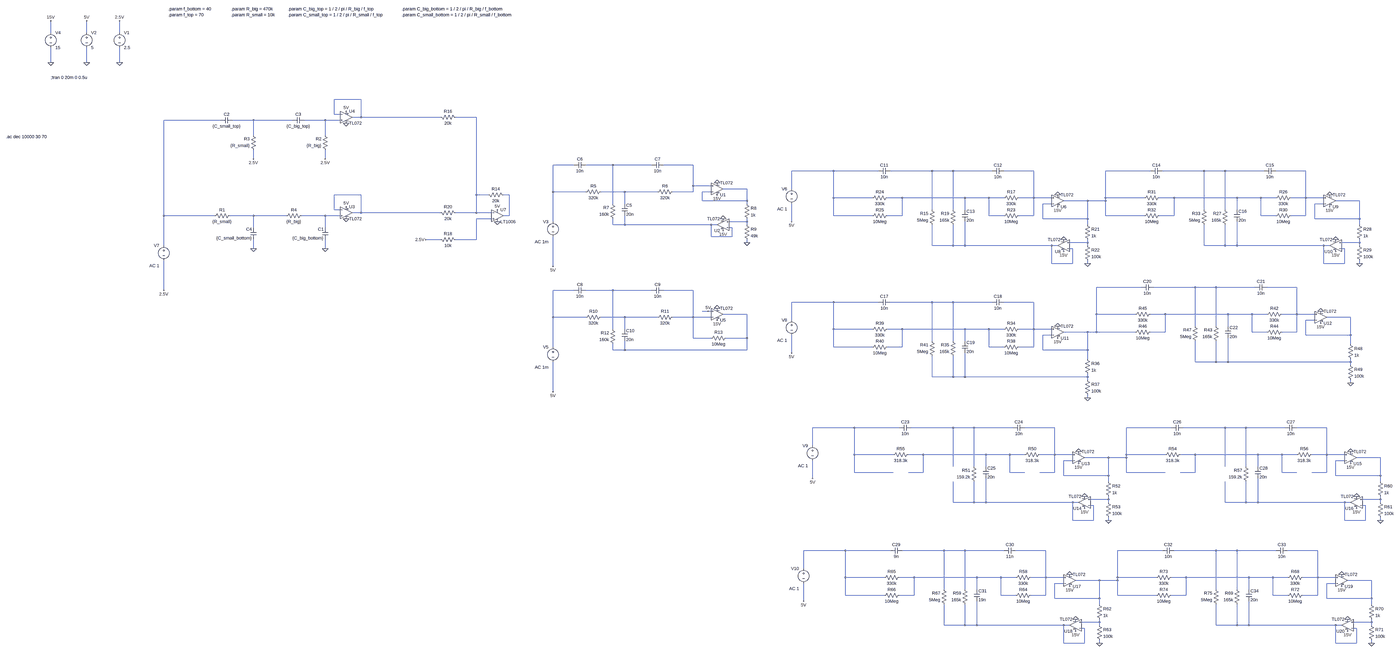
[diagram p0: schematic mains_bandstop_2.asc, whole sheet]
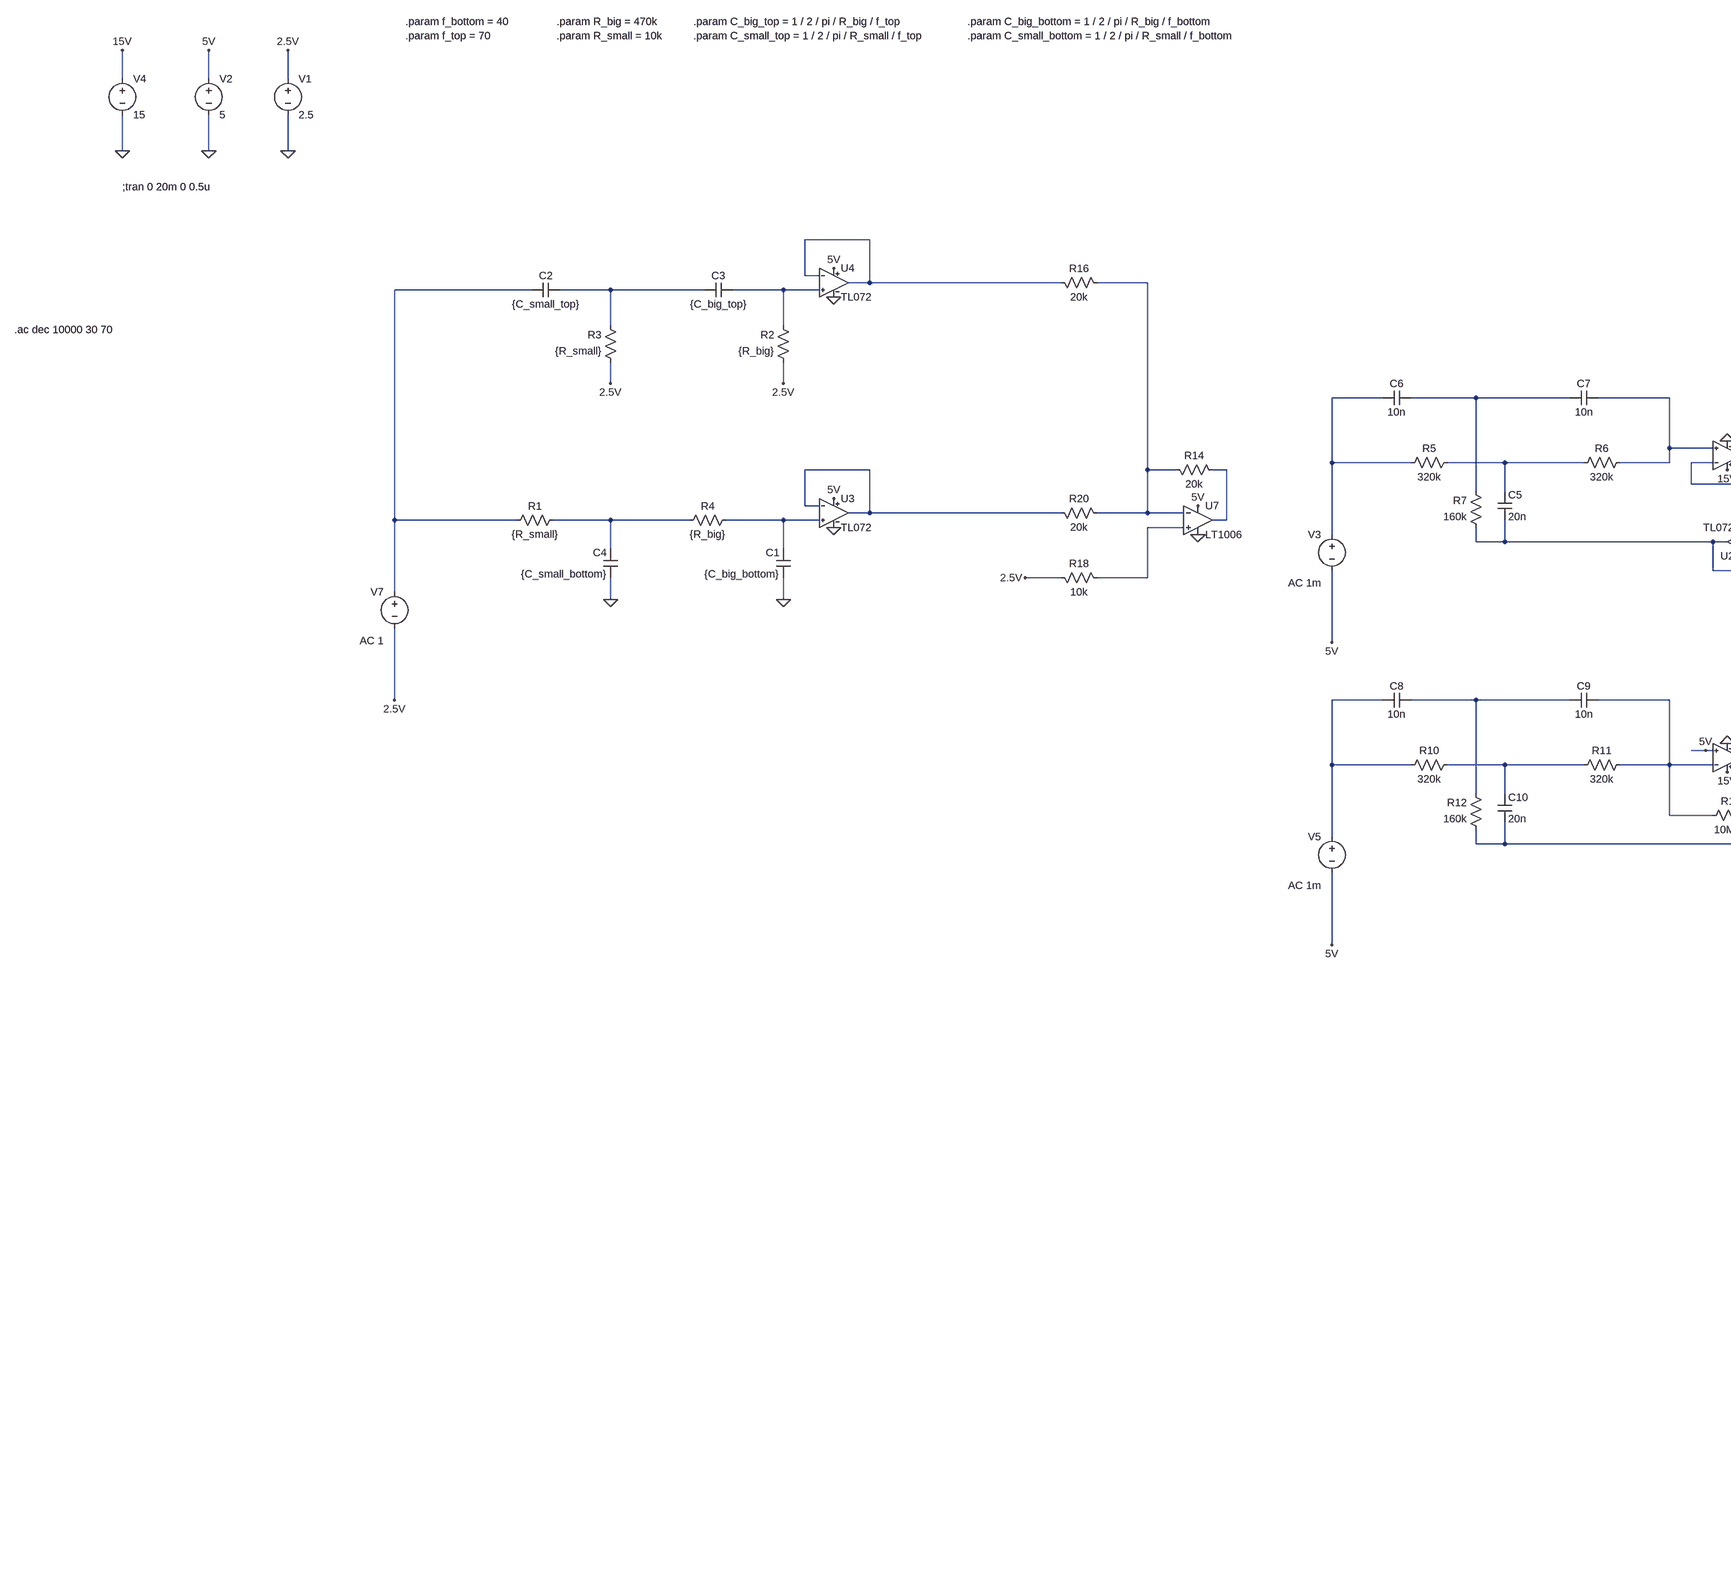
[diagram p1: schematic mains_bandstop_2.asc, part, row 1 of 1, column 1 of 2]
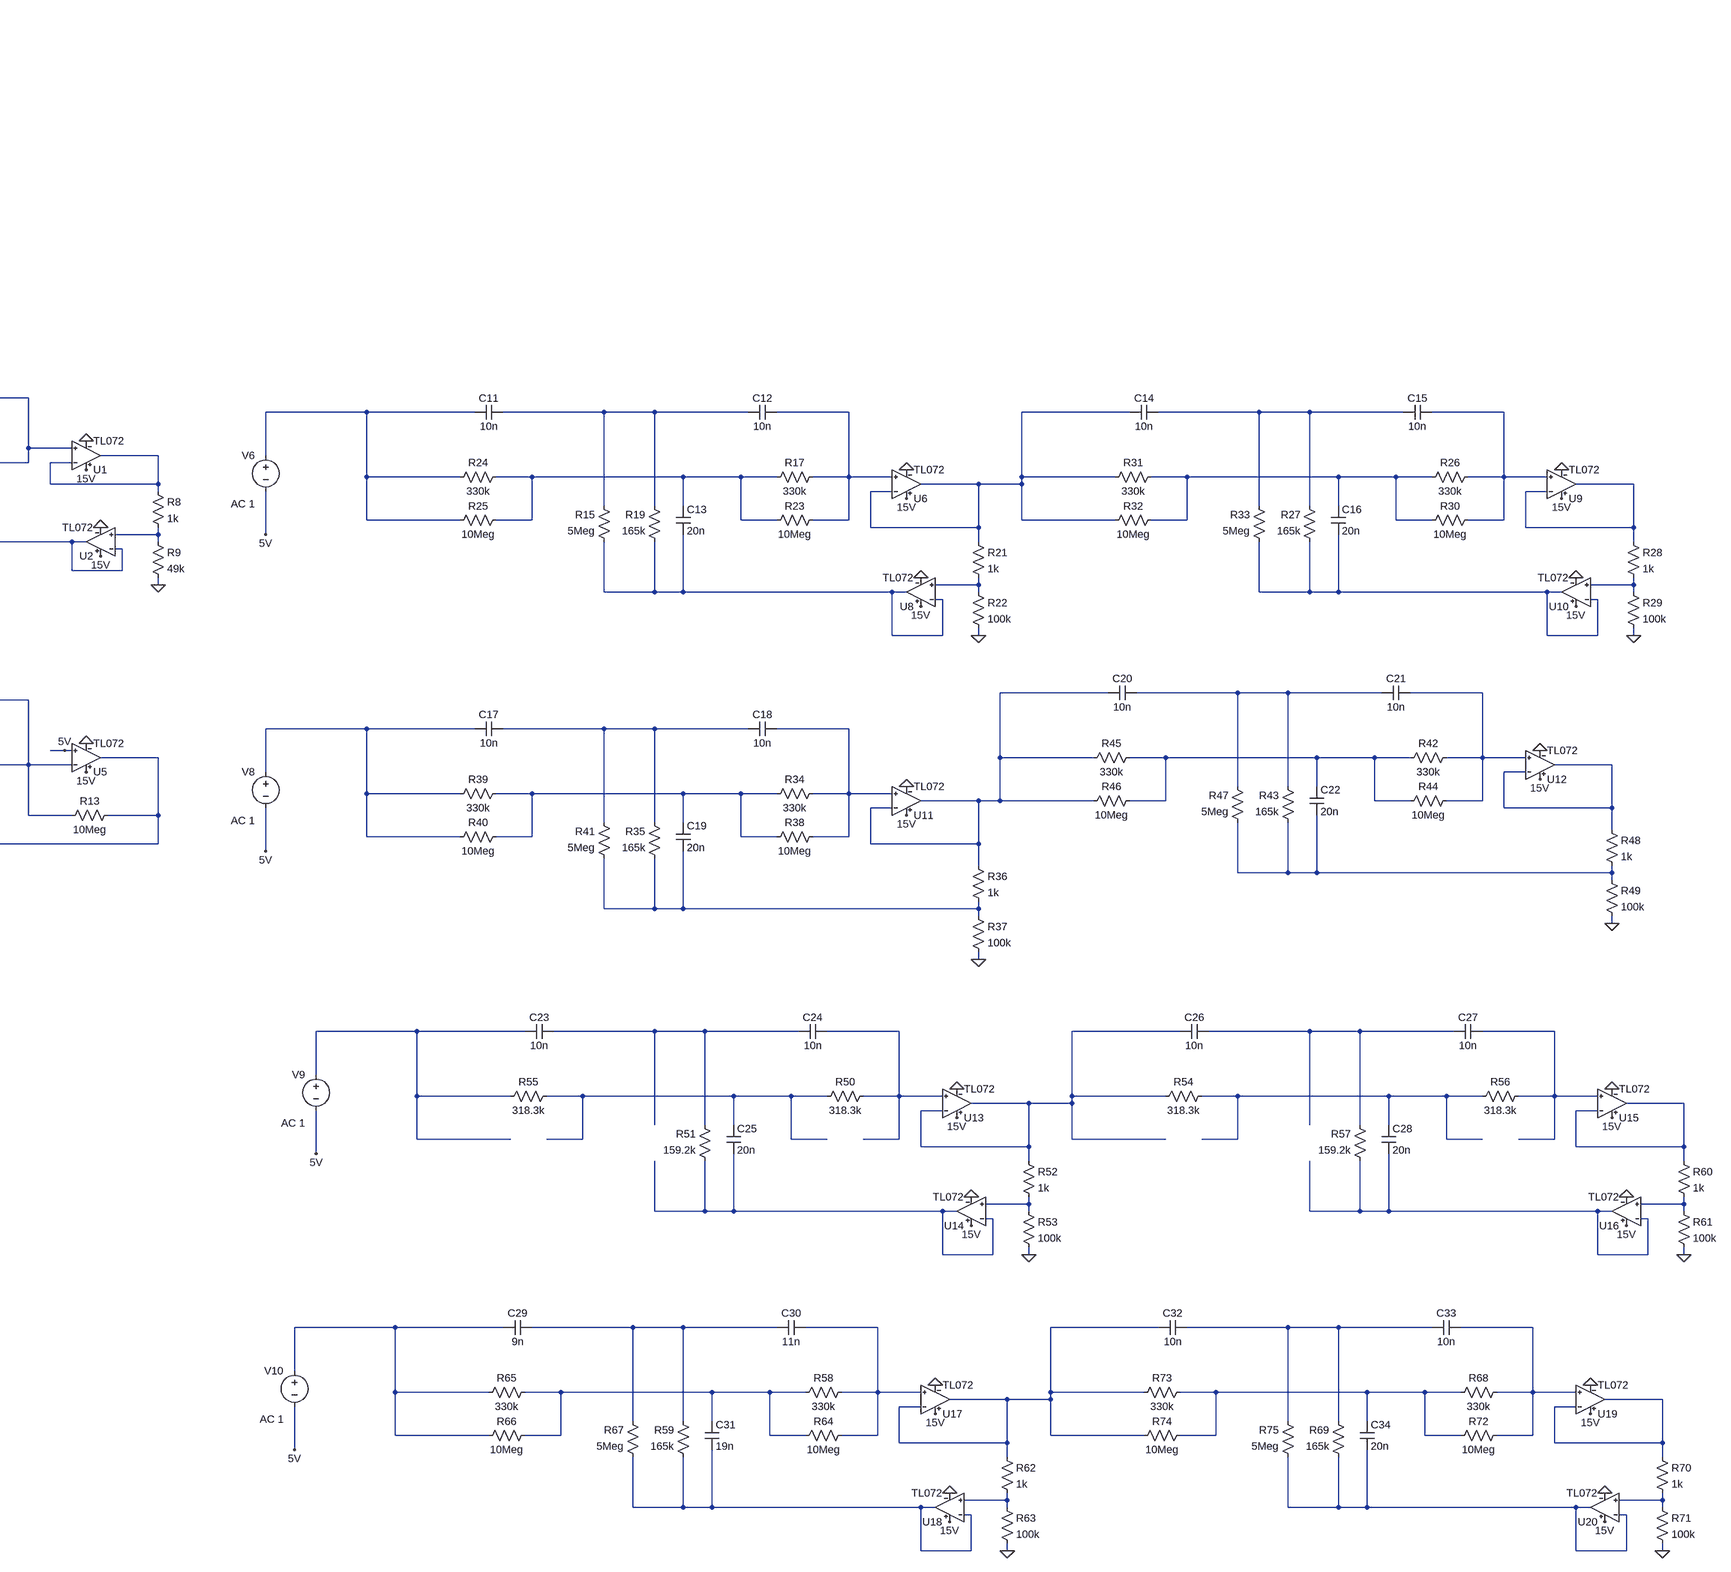
[diagram p2: schematic mains_bandstop_2.asc, part, row 1 of 1, column 2 of 2]
mains_bandstop_2.asc, the LTspice schematic file:
Version 4
SHEET 1 5728 3468
WIRE -1648 -272 -1648 -336
WIRE -1456 -272 -1456 -336
WIRE -1280 -272 -1280 -336
WIRE -1648 -112 -1648 -192
WIRE -1456 -112 -1456 -192
WIRE -1280 -112 -1280 -192
WIRE 48 160 -96 160
WIRE -96 240 -96 160
WIRE -64 240 -96 240
WIRE 48 256 48 160
WIRE 48 256 0 256
WIRE 480 256 48 256
WIRE 672 256 560 256
WIRE -704 272 -1008 272
WIRE -528 272 -640 272
WIRE -320 272 -528 272
WIRE -144 272 -256 272
WIRE -64 272 -144 272
WIRE -528 352 -528 272
WIRE -144 352 -144 272
WIRE -528 480 -528 432
WIRE -144 480 -144 432
WIRE 1264 512 1152 512
WIRE 1472 512 1328 512
WIRE 1680 512 1472 512
WIRE 1904 512 1744 512
WIRE 2720 544 2496 544
WIRE 2960 544 2720 544
WIRE 3248 544 3024 544
WIRE 3360 544 3248 544
WIRE 3568 544 3360 544
WIRE 3792 544 3632 544
WIRE 4416 544 4176 544
WIRE 4704 544 4480 544
WIRE 4816 544 4704 544
WIRE 5024 544 4816 544
WIRE 5248 544 5088 544
WIRE 1904 624 1904 512
WIRE 2000 624 1904 624
WIRE 2192 640 2064 640
WIRE 2496 640 2496 544
WIRE 1152 656 1152 512
WIRE 1328 656 1152 656
WIRE 1536 656 1408 656
WIRE 1712 656 1536 656
WIRE 1904 656 1904 624
WIRE 1904 656 1792 656
WIRE 2000 656 1952 656
WIRE 48 672 -96 672
WIRE 672 672 672 256
WIRE 736 672 672 672
WIRE 848 672 816 672
WIRE 2720 688 2720 544
WIRE 2928 688 2720 688
WIRE 3088 688 3008 688
WIRE 3424 688 3088 688
WIRE 3552 688 3424 688
WIRE 3632 688 3552 688
WIRE 3792 688 3792 544
WIRE 3792 688 3712 688
WIRE 3888 688 3792 688
WIRE 4176 688 4176 544
WIRE 4384 688 4176 688
WIRE 4544 688 4464 688
WIRE 4880 688 4544 688
WIRE 5008 688 4880 688
WIRE 5088 688 5008 688
WIRE 5248 688 5248 544
WIRE 5248 688 5168 688
WIRE 5344 688 5248 688
WIRE 1952 704 1952 656
WIRE 2192 704 2192 640
WIRE 2192 704 1952 704
WIRE 4080 704 3952 704
WIRE 4176 704 4176 688
WIRE 4176 704 4080 704
WIRE 5536 704 5408 704
WIRE 1472 720 1472 512
WIRE 1536 720 1536 656
WIRE 2192 720 2192 704
WIRE 3888 720 3840 720
WIRE 5344 720 5296 720
WIRE -96 752 -96 672
WIRE -64 752 -96 752
WIRE 3248 752 3248 544
WIRE 3360 752 3360 544
WIRE 3424 752 3424 688
WIRE 4704 752 4704 544
WIRE 4816 752 4816 544
WIRE 4880 752 4880 688
WIRE 48 768 48 672
WIRE 48 768 0 768
WIRE 480 768 48 768
WIRE 672 768 672 672
WIRE 672 768 560 768
WIRE 752 768 672 768
WIRE -1008 784 -1008 272
WIRE -736 784 -1008 784
WIRE -528 784 -656 784
WIRE -352 784 -528 784
WIRE -144 784 -272 784
WIRE -64 784 -144 784
WIRE 848 784 848 672
WIRE 848 784 816 784
WIRE 2720 784 2720 688
WIRE 2928 784 2720 784
WIRE 3088 784 3088 688
WIRE 3088 784 3008 784
WIRE 3552 784 3552 688
WIRE 3632 784 3552 784
WIRE 3792 784 3792 688
WIRE 3792 784 3712 784
WIRE 4176 784 4176 704
WIRE 4384 784 4176 784
WIRE 4544 784 4544 688
WIRE 4544 784 4464 784
WIRE 5008 784 5008 688
WIRE 5088 784 5008 784
WIRE 5248 784 5248 688
WIRE 5248 784 5168 784
WIRE 752 800 672 800
WIRE 3840 800 3840 720
WIRE 4080 800 4080 704
WIRE 4080 800 3840 800
WIRE 5296 800 5296 720
WIRE 5536 800 5536 704
WIRE 5536 800 5296 800
WIRE 1152 816 1152 656
WIRE 2192 816 2192 800
WIRE 2192 816 2096 816
WIRE 2496 816 2496 720
WIRE 1472 832 1472 800
WIRE 1536 832 1536 784
WIRE 1536 832 1472 832
WIRE 2000 832 1536 832
WIRE 2032 832 2000 832
WIRE 2192 832 2192 816
WIRE 4080 832 4080 800
WIRE 5536 832 5536 800
WIRE -528 848 -528 784
WIRE -144 848 -144 784
WIRE 2112 848 2096 848
WIRE 2000 896 2000 832
WIRE 2112 896 2112 848
WIRE 2112 896 2000 896
WIRE 480 912 400 912
WIRE 672 912 672 800
WIRE 672 912 560 912
WIRE 2192 928 2192 912
WIRE 4080 928 4080 912
WIRE 4080 928 3984 928
WIRE 5536 928 5536 912
WIRE 5536 928 5440 928
WIRE -1008 944 -1008 784
WIRE 3248 944 3248 832
WIRE 3360 944 3360 832
WIRE 3360 944 3248 944
WIRE 3424 944 3424 816
WIRE 3424 944 3360 944
WIRE 3888 944 3424 944
WIRE 3920 944 3888 944
WIRE 4080 944 4080 928
WIRE 4704 944 4704 832
WIRE 4816 944 4816 832
WIRE 4816 944 4704 944
WIRE 4880 944 4880 816
WIRE 4880 944 4816 944
WIRE 5344 944 4880 944
WIRE 5376 944 5344 944
WIRE 5536 944 5536 928
WIRE -528 960 -528 912
WIRE -144 960 -144 912
WIRE 4000 960 3984 960
WIRE 5456 960 5440 960
WIRE 3888 1040 3888 944
WIRE 4000 1040 4000 960
WIRE 4000 1040 3888 1040
WIRE 4080 1040 4080 1024
WIRE 5344 1040 5344 944
WIRE 5456 1040 5456 960
WIRE 5456 1040 5344 1040
WIRE 5536 1040 5536 1024
WIRE 1152 1056 1152 896
WIRE 4368 1168 4128 1168
WIRE 4656 1168 4432 1168
WIRE 4768 1168 4656 1168
WIRE 4976 1168 4768 1168
WIRE 5200 1168 5040 1168
WIRE -1008 1184 -1008 1024
WIRE 1264 1184 1152 1184
WIRE 1472 1184 1328 1184
WIRE 1680 1184 1472 1184
WIRE 1904 1184 1744 1184
WIRE 2720 1248 2496 1248
WIRE 2960 1248 2720 1248
WIRE 3248 1248 3024 1248
WIRE 3360 1248 3248 1248
WIRE 3568 1248 3360 1248
WIRE 3792 1248 3632 1248
WIRE 1984 1296 1952 1296
WIRE 2000 1296 1984 1296
WIRE 2192 1312 2064 1312
WIRE 4128 1312 4128 1168
WIRE 4336 1312 4128 1312
WIRE 4496 1312 4416 1312
WIRE 4832 1312 4496 1312
WIRE 4960 1312 4832 1312
WIRE 5040 1312 4960 1312
WIRE 5200 1312 5200 1168
WIRE 5200 1312 5120 1312
WIRE 5296 1312 5200 1312
WIRE 1152 1328 1152 1184
WIRE 1328 1328 1152 1328
WIRE 1536 1328 1408 1328
WIRE 1712 1328 1536 1328
WIRE 1904 1328 1904 1184
WIRE 1904 1328 1792 1328
WIRE 2000 1328 1904 1328
WIRE 5488 1328 5360 1328
WIRE 2496 1344 2496 1248
WIRE 5296 1344 5248 1344
WIRE 4656 1376 4656 1168
WIRE 4768 1376 4768 1168
WIRE 4832 1376 4832 1312
WIRE 1472 1392 1472 1184
WIRE 1536 1392 1536 1328
WIRE 2720 1392 2720 1248
WIRE 2928 1392 2720 1392
WIRE 3088 1392 3008 1392
WIRE 3424 1392 3088 1392
WIRE 3552 1392 3424 1392
WIRE 3632 1392 3552 1392
WIRE 3792 1392 3792 1248
WIRE 3792 1392 3712 1392
WIRE 3888 1392 3792 1392
WIRE 4080 1408 3952 1408
WIRE 4128 1408 4128 1312
WIRE 4128 1408 4080 1408
WIRE 4336 1408 4128 1408
WIRE 4496 1408 4496 1312
WIRE 4496 1408 4416 1408
WIRE 4960 1408 4960 1312
WIRE 5040 1408 4960 1408
WIRE 5200 1408 5200 1312
WIRE 5200 1408 5120 1408
WIRE 3888 1424 3840 1424
WIRE 5248 1424 5248 1344
WIRE 5488 1424 5488 1328
WIRE 5488 1424 5248 1424
WIRE 1904 1440 1904 1328
WIRE 2000 1440 1904 1440
WIRE 2192 1440 2192 1312
WIRE 2192 1440 2080 1440
WIRE 3248 1456 3248 1248
WIRE 3360 1456 3360 1248
WIRE 3424 1456 3424 1392
WIRE 5488 1472 5488 1424
WIRE 1152 1488 1152 1328
WIRE 2720 1488 2720 1392
WIRE 2928 1488 2720 1488
WIRE 3088 1488 3088 1392
WIRE 3088 1488 3008 1488
WIRE 3552 1488 3552 1392
WIRE 3632 1488 3552 1488
WIRE 3792 1488 3792 1392
WIRE 3792 1488 3712 1488
WIRE 1472 1504 1472 1472
WIRE 1536 1504 1536 1456
WIRE 1536 1504 1472 1504
WIRE 2192 1504 2192 1440
WIRE 2192 1504 1536 1504
WIRE 3840 1504 3840 1424
WIRE 4080 1504 4080 1408
WIRE 4080 1504 3840 1504
WIRE 2496 1520 2496 1424
WIRE 4080 1552 4080 1504
WIRE 4656 1568 4656 1456
WIRE 4768 1568 4768 1456
WIRE 4768 1568 4656 1568
WIRE 4832 1568 4832 1440
WIRE 4832 1568 4768 1568
WIRE 5488 1568 5488 1552
WIRE 5488 1568 4832 1568
WIRE 5488 1584 5488 1568
WIRE 3248 1648 3248 1536
WIRE 3360 1648 3360 1536
WIRE 3360 1648 3248 1648
WIRE 3424 1648 3424 1520
WIRE 3424 1648 3360 1648
WIRE 4080 1648 4080 1632
WIRE 4080 1648 3424 1648
WIRE 4080 1664 4080 1648
WIRE 5488 1680 5488 1664
WIRE 1152 1728 1152 1568
WIRE 4080 1760 4080 1744
WIRE 2832 1984 2608 1984
WIRE 3072 1984 2832 1984
WIRE 3360 1984 3136 1984
WIRE 3472 1984 3360 1984
WIRE 3680 1984 3472 1984
WIRE 3904 1984 3744 1984
WIRE 4528 1984 4288 1984
WIRE 4816 1984 4592 1984
WIRE 4928 1984 4816 1984
WIRE 5136 1984 4928 1984
WIRE 5360 1984 5200 1984
WIRE 2608 2080 2608 1984
WIRE 2832 2128 2832 1984
WIRE 3040 2128 2832 2128
WIRE 3200 2128 3120 2128
WIRE 3536 2128 3200 2128
WIRE 3664 2128 3536 2128
WIRE 3744 2128 3664 2128
WIRE 3904 2128 3904 1984
WIRE 3904 2128 3824 2128
WIRE 4000 2128 3904 2128
WIRE 4288 2128 4288 1984
WIRE 4496 2128 4288 2128
WIRE 4656 2128 4576 2128
WIRE 4992 2128 4656 2128
WIRE 5120 2128 4992 2128
WIRE 5200 2128 5120 2128
WIRE 5360 2128 5360 1984
WIRE 5360 2128 5280 2128
WIRE 5456 2128 5360 2128
WIRE 4192 2144 4064 2144
WIRE 4288 2144 4288 2128
WIRE 4288 2144 4192 2144
WIRE 5648 2144 5520 2144
WIRE 4000 2160 3952 2160
WIRE 5456 2160 5408 2160
WIRE 3360 2192 3360 1984
WIRE 3472 2192 3472 1984
WIRE 3536 2192 3536 2128
WIRE 4816 2192 4816 1984
WIRE 4928 2192 4928 1984
WIRE 4992 2192 4992 2128
WIRE 2832 2224 2832 2128
WIRE 3040 2224 2832 2224
WIRE 3200 2224 3200 2128
WIRE 3200 2224 3120 2224
WIRE 3664 2224 3664 2128
WIRE 3744 2224 3664 2224
WIRE 3904 2224 3904 2128
WIRE 3904 2224 3824 2224
WIRE 4288 2224 4288 2144
WIRE 4496 2224 4288 2224
WIRE 4656 2224 4656 2128
WIRE 4656 2224 4576 2224
WIRE 5120 2224 5120 2128
WIRE 5200 2224 5120 2224
WIRE 5360 2224 5360 2128
WIRE 5360 2224 5280 2224
WIRE 3952 2240 3952 2160
WIRE 4192 2240 4192 2144
WIRE 4192 2240 3952 2240
WIRE 5408 2240 5408 2160
WIRE 5648 2240 5648 2144
WIRE 5648 2240 5408 2240
WIRE 2608 2256 2608 2160
WIRE 4192 2272 4192 2240
WIRE 5648 2272 5648 2240
WIRE 4192 2368 4192 2352
WIRE 4192 2368 4096 2368
WIRE 5648 2368 5648 2352
WIRE 5648 2368 5552 2368
WIRE 3360 2384 3360 2272
WIRE 3472 2384 3472 2272
WIRE 3472 2384 3360 2384
WIRE 3536 2384 3536 2256
WIRE 3536 2384 3472 2384
WIRE 4000 2384 3536 2384
WIRE 4032 2384 4000 2384
WIRE 4192 2384 4192 2368
WIRE 4816 2384 4816 2272
WIRE 4928 2384 4928 2272
WIRE 4928 2384 4816 2384
WIRE 4992 2384 4992 2256
WIRE 4992 2384 4928 2384
WIRE 5456 2384 4992 2384
WIRE 5488 2384 5456 2384
WIRE 5648 2384 5648 2368
WIRE 4112 2400 4096 2400
WIRE 5568 2400 5552 2400
WIRE 4000 2480 4000 2384
WIRE 4112 2480 4112 2400
WIRE 4112 2480 4000 2480
WIRE 4192 2480 4192 2464
WIRE 5456 2480 5456 2384
WIRE 5568 2480 5568 2400
WIRE 5568 2480 5456 2480
WIRE 5648 2480 5648 2464
WIRE 2784 2944 2560 2944
WIRE 3024 2944 2784 2944
WIRE 3312 2944 3088 2944
WIRE 3424 2944 3312 2944
WIRE 3632 2944 3424 2944
WIRE 3856 2944 3696 2944
WIRE 4480 2944 4240 2944
WIRE 4768 2944 4544 2944
WIRE 4880 2944 4768 2944
WIRE 5088 2944 4880 2944
WIRE 5312 2944 5152 2944
WIRE 2560 3040 2560 2944
WIRE 2784 3088 2784 2944
WIRE 2992 3088 2784 3088
WIRE 3152 3088 3072 3088
WIRE 3488 3088 3152 3088
WIRE 3616 3088 3488 3088
WIRE 3696 3088 3616 3088
WIRE 3856 3088 3856 2944
WIRE 3856 3088 3776 3088
WIRE 3952 3088 3856 3088
WIRE 4240 3088 4240 2944
WIRE 4448 3088 4240 3088
WIRE 4608 3088 4528 3088
WIRE 4944 3088 4608 3088
WIRE 5072 3088 4944 3088
WIRE 5152 3088 5072 3088
WIRE 5312 3088 5312 2944
WIRE 5312 3088 5232 3088
WIRE 5408 3088 5312 3088
WIRE 4144 3104 4016 3104
WIRE 4240 3104 4240 3088
WIRE 4240 3104 4144 3104
WIRE 5600 3104 5472 3104
WIRE 3952 3120 3904 3120
WIRE 5408 3120 5360 3120
WIRE 3312 3152 3312 2944
WIRE 3424 3152 3424 2944
WIRE 3488 3152 3488 3088
WIRE 4768 3152 4768 2944
WIRE 4880 3152 4880 2944
WIRE 4944 3152 4944 3088
WIRE 2784 3184 2784 3088
WIRE 2992 3184 2784 3184
WIRE 3152 3184 3152 3088
WIRE 3152 3184 3072 3184
WIRE 3616 3184 3616 3088
WIRE 3696 3184 3616 3184
WIRE 3856 3184 3856 3088
WIRE 3856 3184 3776 3184
WIRE 4240 3184 4240 3104
WIRE 4448 3184 4240 3184
WIRE 4608 3184 4608 3088
WIRE 4608 3184 4528 3184
WIRE 5072 3184 5072 3088
WIRE 5152 3184 5072 3184
WIRE 5312 3184 5312 3088
WIRE 5312 3184 5232 3184
WIRE 3904 3200 3904 3120
WIRE 4144 3200 4144 3104
WIRE 4144 3200 3904 3200
WIRE 5360 3200 5360 3120
WIRE 5600 3200 5600 3104
WIRE 5600 3200 5360 3200
WIRE 2560 3216 2560 3120
WIRE 4144 3232 4144 3200
WIRE 5600 3232 5600 3200
WIRE 4144 3328 4144 3312
WIRE 4144 3328 4048 3328
WIRE 5600 3328 5600 3312
WIRE 5600 3328 5504 3328
WIRE 3312 3344 3312 3232
WIRE 3424 3344 3424 3232
WIRE 3424 3344 3312 3344
WIRE 3488 3344 3488 3216
WIRE 3488 3344 3424 3344
WIRE 3952 3344 3488 3344
WIRE 3984 3344 3952 3344
WIRE 4144 3344 4144 3328
WIRE 4768 3344 4768 3232
WIRE 4880 3344 4880 3232
WIRE 4880 3344 4768 3344
WIRE 4944 3344 4944 3216
WIRE 4944 3344 4880 3344
WIRE 5408 3344 4944 3344
WIRE 5440 3344 5408 3344
WIRE 5600 3344 5600 3328
WIRE 4064 3360 4048 3360
WIRE 5520 3360 5504 3360
WIRE 3952 3440 3952 3344
WIRE 4064 3440 4064 3360
WIRE 4064 3440 3952 3440
WIRE 4144 3440 4144 3424
WIRE 5408 3440 5408 3344
WIRE 5520 3440 5520 3360
WIRE 5520 3440 5408 3440
WIRE 5600 3440 5600 3424
FLAG -1456 -112 0
FLAG -1456 -336 5V
FLAG 784 816 0
FLAG 784 752 5V
FLAG 400 912 2.5V
FLAG -1280 -112 0
FLAG -1280 -336 2.5V
FLAG -32 800 0
FLAG -32 736 5V
FLAG -144 960 0
FLAG -32 288 0
FLAG -32 224 5V
FLAG -1008 1184 2.5V
FLAG -144 480 2.5V
FLAG -528 480 2.5V
FLAG -528 960 0
FLAG 2032 608 0
FLAG 2032 672 15V
FLAG 1152 1056 5V
FLAG 2064 800 0
FLAG 2064 864 15V
FLAG 2192 928 0
FLAG -1648 -112 0
FLAG -1648 -336 15V
FLAG 2032 1280 0
FLAG 2032 1344 15V
FLAG 1152 1728 5V
FLAG 1984 1296 5V
FLAG 3920 672 0
FLAG 3920 736 15V
FLAG 2496 816 5V
FLAG 3952 912 0
FLAG 3952 976 15V
FLAG 4080 1040 0
FLAG 5376 672 0
FLAG 5376 736 15V
FLAG 5408 912 0
FLAG 5408 976 15V
FLAG 5536 1040 0
FLAG 3920 1376 0
FLAG 3920 1440 15V
FLAG 2496 1520 5V
FLAG 4080 1760 0
FLAG 5328 1296 0
FLAG 5328 1360 15V
FLAG 5488 1680 0
FLAG 4032 2112 0
FLAG 4032 2176 15V
FLAG 4064 2352 0
FLAG 4064 2416 15V
FLAG 4192 2480 0
FLAG 5488 2112 0
FLAG 5488 2176 15V
FLAG 5520 2352 0
FLAG 5520 2416 15V
FLAG 5648 2480 0
FLAG 2608 2256 5V
FLAG 3984 3072 0
FLAG 3984 3136 15V
FLAG 2560 3216 5V
FLAG 4016 3312 0
FLAG 4016 3376 15V
FLAG 4144 3440 0
FLAG 5440 3072 0
FLAG 5440 3136 15V
FLAG 5472 3312 0
FLAG 5472 3376 15V
FLAG 5600 3440 0
SYMBOL voltage -1456 -288 R0
WINDOW 123 0 0 Left 0
WINDOW 39 0 0 Left 0
SYMATTR InstName V2
SYMATTR Value 5
SYMBOL voltage -1008 928 M0
WINDOW 123 24 124 Left 2
WINDOW 39 0 0 Left 0
SYMATTR Value2 AC 1
SYMATTR InstName V7
SYMATTR Value ""
SYMBOL res 720 656 M90
WINDOW 0 0 56 VBottom 2
WINDOW 3 32 56 VTop 2
SYMATTR InstName R14
SYMATTR Value 20k
SYMBOL OpAmps\\LT1006 784 720 R0
SYMATTR InstName U7
SYMBOL res 464 896 M90
WINDOW 0 0 56 VBottom 2
WINDOW 3 32 56 VTop 2
SYMATTR InstName R18
SYMATTR Value 10k
SYMBOL res 464 240 M90
WINDOW 0 0 56 VBottom 2
WINDOW 3 32 56 VTop 2
SYMATTR InstName R16
SYMATTR Value 20k
SYMBOL res 464 752 M90
WINDOW 0 0 56 VBottom 2
WINDOW 3 32 56 VTop 2
SYMATTR InstName R20
SYMATTR Value 20k
SYMBOL voltage -1280 -288 R0
WINDOW 123 0 0 Left 0
WINDOW 39 0 0 Left 0
SYMATTR InstName V1
SYMATTR Value 2.5
SYMBOL cap -640 256 R90
WINDOW 0 0 32 VBottom 2
WINDOW 3 32 32 VTop 2
SYMATTR InstName C2
SYMATTR Value {C_small_top}
SYMBOL res -128 448 R180
WINDOW 0 36 76 Left 2
WINDOW 3 36 40 Left 2
SYMATTR InstName R2
SYMATTR Value {R_big}
SYMBOL cap -256 256 R90
WINDOW 0 0 32 VBottom 2
WINDOW 3 32 32 VTop 2
SYMATTR InstName C3
SYMATTR Value {C_big_top}
SYMBOL res -512 448 R180
WINDOW 0 36 76 Left 2
WINDOW 3 36 40 Left 2
SYMATTR InstName R3
SYMATTR Value {R_small}
SYMBOL ZZZ\\OpAmp\\TL072 -32 768 R0
SYMATTR InstName U3
SYMBOL ZZZ\\OpAmp\\TL072 -32 256 R0
SYMATTR InstName U4
SYMBOL res -752 800 R270
WINDOW 0 32 56 VTop 2
WINDOW 3 0 56 VBottom 2
SYMATTR InstName R1
SYMATTR Value {R_small}
SYMBOL res -368 800 R270
WINDOW 0 32 56 VTop 2
WINDOW 3 0 56 VBottom 2
SYMATTR InstName R4
SYMATTR Value {R_big}
SYMBOL cap -512 912 R180
WINDOW 0 24 56 Left 2
WINDOW 3 24 8 Left 2
SYMATTR InstName C4
SYMATTR Value {C_small_bottom}
SYMBOL cap -128 912 R180
WINDOW 0 24 56 Left 2
WINDOW 3 24 8 Left 2
SYMATTR InstName C1
SYMATTR Value {C_big_bottom}
SYMBOL ZZZ\\OpAmp\\TL072 2032 640 M180
SYMATTR InstName U1
SYMBOL res 1312 672 R270
WINDOW 0 32 56 VTop 2
WINDOW 3 0 56 VBottom 2
SYMATTR InstName R5
SYMATTR Value 320k
SYMBOL voltage 1152 800 M0
WINDOW 123 24 124 Left 2
WINDOW 39 0 0 Left 0
SYMATTR Value2 AC 1m
SYMATTR InstName V3
SYMATTR Value ""
SYMBOL res 1696 672 R270
WINDOW 0 32 56 VTop 2
WINDOW 3 0 56 VBottom 2
SYMATTR InstName R6
SYMATTR Value 320k
SYMBOL res 1488 816 R180
WINDOW 0 36 76 Left 2
WINDOW 3 36 40 Left 2
SYMATTR InstName R7
SYMATTR Value 160k
SYMBOL cap 1264 528 R270
WINDOW 0 32 32 VTop 2
WINDOW 3 0 32 VBottom 2
SYMATTR InstName C6
SYMATTR Value 10n
SYMBOL cap 1680 528 R270
WINDOW 0 32 32 VTop 2
WINDOW 3 0 32 VBottom 2
SYMATTR InstName C7
SYMATTR Value 10n
SYMBOL cap 1520 720 R0
SYMATTR InstName C5
SYMATTR Value 20n
SYMBOL ZZZ\\OpAmp\\TL072 2064 832 R180
SYMATTR InstName U2
SYMBOL res 2176 704 R0
SYMATTR InstName R8
SYMATTR Value 1k
SYMBOL res 2176 816 R0
SYMATTR InstName R9
SYMATTR Value 49k
SYMBOL voltage -1648 -288 R0
WINDOW 123 0 0 Left 0
WINDOW 39 0 0 Left 0
SYMATTR InstName V4
SYMATTR Value 15
SYMBOL ZZZ\\OpAmp\\TL072 2032 1312 M180
SYMATTR InstName U5
SYMBOL res 1312 1344 R270
WINDOW 0 32 56 VTop 2
WINDOW 3 0 56 VBottom 2
SYMATTR InstName R10
SYMATTR Value 320k
SYMBOL voltage 1152 1472 M0
WINDOW 123 24 124 Left 2
WINDOW 39 0 0 Left 0
SYMATTR Value2 AC 1m
SYMATTR InstName V5
SYMATTR Value ""
SYMBOL res 1696 1344 R270
WINDOW 0 32 56 VTop 2
WINDOW 3 0 56 VBottom 2
SYMATTR InstName R11
SYMATTR Value 320k
SYMBOL res 1488 1488 R180
WINDOW 0 36 76 Left 2
WINDOW 3 36 40 Left 2
SYMATTR InstName R12
SYMATTR Value 160k
SYMBOL cap 1264 1200 R270
WINDOW 0 32 32 VTop 2
WINDOW 3 0 32 VBottom 2
SYMATTR InstName C8
SYMATTR Value 10n
SYMBOL cap 1680 1200 R270
WINDOW 0 32 32 VTop 2
WINDOW 3 0 32 VBottom 2
SYMATTR InstName C9
SYMATTR Value 10n
SYMBOL cap 1520 1392 R0
SYMATTR InstName C10
SYMATTR Value 20n
SYMBOL res 2096 1424 R90
WINDOW 0 0 56 VBottom 2
WINDOW 3 32 56 VTop 2
SYMATTR InstName R13
SYMATTR Value 10Meg
SYMBOL ZZZ\\OpAmp\\TL072 3920 704 M180
SYMATTR InstName U6
SYMBOL voltage 2496 624 M0
WINDOW 123 24 124 Left 2
WINDOW 39 0 0 Left 0
SYMATTR Value2 AC 1
SYMATTR InstName V6
SYMATTR Value ""
SYMBOL res 3616 704 R270
WINDOW 0 32 56 VTop 2
WINDOW 3 0 56 VBottom 2
SYMATTR InstName R17
SYMATTR Value 330k
SYMBOL res 3376 848 R180
WINDOW 0 36 76 Left 2
WINDOW 3 36 40 Left 2
SYMATTR InstName R19
SYMATTR Value 165k
SYMBOL cap 2960 560 R270
WINDOW 0 32 32 VTop 2
WINDOW 3 0 32 VBottom 2
SYMATTR InstName C11
SYMATTR Value 10n
SYMBOL cap 3568 560 R270
WINDOW 0 32 32 VTop 2
WINDOW 3 0 32 VBottom 2
SYMATTR InstName C12
SYMATTR Value 10n
SYMBOL cap 3408 752 R0
SYMATTR InstName C13
SYMATTR Value 20n
SYMBOL ZZZ\\OpAmp\\TL072 3952 944 R180
SYMATTR InstName U8
SYMBOL res 4064 816 R0
SYMATTR InstName R21
SYMATTR Value 1k
SYMBOL res 4064 928 R0
SYMATTR InstName R22
SYMATTR Value 100k
SYMBOL res 3728 768 R90
WINDOW 0 0 56 VBottom 2
WINDOW 3 32 56 VTop 2
SYMATTR InstName R23
SYMATTR Value 10Meg
SYMBOL res 2912 704 R270
WINDOW 0 32 56 VTop 2
WINDOW 3 0 56 VBottom 2
SYMATTR InstName R24
SYMATTR Value 330k
SYMBOL res 3024 768 R90
WINDOW 0 0 56 VBottom 2
WINDOW 3 32 56 VTop 2
SYMATTR InstName R25
SYMATTR Value 10Meg
SYMBOL res 3264 848 R180
WINDOW 0 36 76 Left 2
WINDOW 3 36 40 Left 2
SYMATTR InstName R15
SYMATTR Value 5Meg
SYMBOL ZZZ\\OpAmp\\TL072 5376 704 M180
SYMATTR InstName U9
SYMBOL res 5072 704 R270
WINDOW 0 32 56 VTop 2
WINDOW 3 0 56 VBottom 2
SYMATTR InstName R26
SYMATTR Value 330k
SYMBOL res 4832 848 R180
WINDOW 0 36 76 Left 2
WINDOW 3 36 40 Left 2
SYMATTR InstName R27
SYMATTR Value 165k
SYMBOL cap 4416 560 R270
WINDOW 0 32 32 VTop 2
WINDOW 3 0 32 VBottom 2
SYMATTR InstName C14
SYMATTR Value 10n
SYMBOL cap 5024 560 R270
WINDOW 0 32 32 VTop 2
WINDOW 3 0 32 VBottom 2
SYMATTR InstName C15
SYMATTR Value 10n
SYMBOL cap 4864 752 R0
SYMATTR InstName C16
SYMATTR Value 20n
SYMBOL ZZZ\\OpAmp\\TL072 5408 944 R180
SYMATTR InstName U10
SYMBOL res 5520 816 R0
SYMATTR InstName R28
SYMATTR Value 1k
SYMBOL res 5520 928 R0
SYMATTR InstName R29
SYMATTR Value 100k
SYMBOL res 5184 768 R90
WINDOW 0 0 56 VBottom 2
WINDOW 3 32 56 VTop 2
SYMATTR InstName R30
SYMATTR Value 10Meg
SYMBOL res 4368 704 R270
WINDOW 0 32 56 VTop 2
WINDOW 3 0 56 VBottom 2
SYMATTR InstName R31
SYMATTR Value 330k
SYMBOL res 4480 768 R90
WINDOW 0 0 56 VBottom 2
WINDOW 3 32 56 VTop 2
SYMATTR InstName R32
SYMATTR Value 10Meg
SYMBOL res 4720 848 R180
WINDOW 0 36 76 Left 2
WINDOW 3 36 40 Left 2
SYMATTR InstName R33
SYMATTR Value 5Meg
SYMBOL ZZZ\\OpAmp\\TL072 3920 1408 M180
SYMATTR InstName U11
SYMBOL voltage 2496 1328 M0
WINDOW 123 24 124 Left 2
WINDOW 39 0 0 Left 0
SYMATTR Value2 AC 1
SYMATTR InstName V8
SYMATTR Value ""
SYMBOL res 3616 1408 R270
WINDOW 0 32 56 VTop 2
WINDOW 3 0 56 VBottom 2
SYMATTR InstName R34
SYMATTR Value 330k
SYMBOL res 3376 1552 R180
WINDOW 0 36 76 Left 2
WINDOW 3 36 40 Left 2
SYMATTR InstName R35
SYMATTR Value 165k
SYMBOL cap 2960 1264 R270
WINDOW 0 32 32 VTop 2
WINDOW 3 0 32 VBottom 2
SYMATTR InstName C17
SYMATTR Value 10n
SYMBOL cap 3568 1264 R270
WINDOW 0 32 32 VTop 2
WINDOW 3 0 32 VBottom 2
SYMATTR InstName C18
SYMATTR Value 10n
SYMBOL cap 3408 1456 R0
SYMATTR InstName C19
SYMATTR Value 20n
SYMBOL res 3728 1472 R90
WINDOW 0 0 56 VBottom 2
WINDOW 3 32 56 VTop 2
SYMATTR InstName R38
SYMATTR Value 10Meg
SYMBOL res 2912 1408 R270
WINDOW 0 32 56 VTop 2
WINDOW 3 0 56 VBottom 2
SYMATTR InstName R39
SYMATTR Value 330k
SYMBOL res 3024 1472 R90
WINDOW 0 0 56 VBottom 2
WINDOW 3 32 56 VTop 2
SYMATTR InstName R40
SYMATTR Value 10Meg
SYMBOL res 3264 1552 R180
WINDOW 0 36 76 Left 2
WINDOW 3 36 40 Left 2
SYMATTR InstName R41
SYMATTR Value 5Meg
SYMBOL res 4064 1536 R0
SYMATTR InstName R36
SYMATTR Value 1k
SYMBOL res 4064 1648 R0
SYMATTR InstName R37
SYMATTR Value 100k
SYMBOL ZZZ\\OpAmp\\TL072 5328 1328 M180
SYMATTR InstName U12
SYMBOL res 5024 1328 R270
WINDOW 0 32 56 VTop 2
WINDOW 3 0 56 VBottom 2
SYMATTR InstName R42
SYMATTR Value 330k
SYMBOL res 4784 1472 R180
WINDOW 0 36 76 Left 2
WINDOW 3 36 40 Left 2
SYMATTR InstName R43
SYMATTR Value 165k
SYMBOL cap 4368 1184 R270
WINDOW 0 32 32 VTop 2
WINDOW 3 0 32 VBottom 2
SYMATTR InstName C20
SYMATTR Value 10n
SYMBOL cap 4976 1184 R270
WINDOW 0 32 32 VTop 2
WINDOW 3 0 32 VBottom 2
SYMATTR InstName C21
SYMATTR Value 10n
SYMBOL cap 4816 1376 R0
SYMATTR InstName C22
SYMATTR Value 20n
SYMBOL res 5136 1392 R90
WINDOW 0 0 56 VBottom 2
WINDOW 3 32 56 VTop 2
SYMATTR InstName R44
SYMATTR Value 10Meg
SYMBOL res 4320 1328 R270
WINDOW 0 32 56 VTop 2
WINDOW 3 0 56 VBottom 2
SYMATTR InstName R45
SYMATTR Value 330k
SYMBOL res 4432 1392 R90
WINDOW 0 0 56 VBottom 2
WINDOW 3 32 56 VTop 2
SYMATTR InstName R46
SYMATTR Value 10Meg
SYMBOL res 4672 1472 R180
WINDOW 0 36 76 Left 2
WINDOW 3 36 40 Left 2
SYMATTR InstName R47
SYMATTR Value 5Meg
SYMBOL res 5472 1456 R0
SYMATTR InstName R48
SYMATTR Value 1k
SYMBOL res 5472 1568 R0
SYMATTR InstName R49
SYMATTR Value 100k
SYMBOL ZZZ\\OpAmp\\TL072 4032 2144 M180
SYMATTR InstName U13
SYMBOL res 3728 2144 R270
WINDOW 0 32 56 VTop 2
WINDOW 3 0 56 VBottom 2
SYMATTR InstName R50
SYMATTR Value 318.3k
SYMBOL res 3488 2288 R180
WINDOW 0 36 76 Left 2
WINDOW 3 36 40 Left 2
SYMATTR InstName R51
SYMATTR Value 159.2k
SYMBOL cap 3072 2000 R270
WINDOW 0 32 32 VTop 2
WINDOW 3 0 32 VBottom 2
SYMATTR InstName C23
SYMATTR Value 10n
SYMBOL cap 3680 2000 R270
WINDOW 0 32 32 VTop 2
WINDOW 3 0 32 VBottom 2
SYMATTR InstName C24
SYMATTR Value 10n
SYMBOL cap 3520 2192 R0
SYMATTR InstName C25
SYMATTR Value 20n
SYMBOL ZZZ\\OpAmp\\TL072 4064 2384 R180
SYMATTR InstName U14
SYMBOL res 4176 2256 R0
SYMATTR InstName R52
SYMATTR Value 1k
SYMBOL res 4176 2368 R0
SYMATTR InstName R53
SYMATTR Value 100k
SYMBOL res 3024 2144 R270
WINDOW 0 32 56 VTop 2
WINDOW 3 0 56 VBottom 2
SYMATTR InstName R55
SYMATTR Value 318.3k
SYMBOL ZZZ\\OpAmp\\TL072 5488 2144 M180
SYMATTR InstName U15
SYMBOL cap 4528 2000 R270
WINDOW 0 32 32 VTop 2
WINDOW 3 0 32 VBottom 2
SYMATTR InstName C26
SYMATTR Value 10n
SYMBOL cap 5136 2000 R270
WINDOW 0 32 32 VTop 2
WINDOW 3 0 32 VBottom 2
SYMATTR InstName C27
SYMATTR Value 10n
SYMBOL cap 4976 2192 R0
SYMATTR InstName C28
SYMATTR Value 20n
SYMBOL ZZZ\\OpAmp\\TL072 5520 2384 R180
SYMATTR InstName U16
SYMBOL res 5632 2256 R0
SYMATTR InstName R60
SYMATTR Value 1k
SYMBOL res 5632 2368 R0
SYMATTR InstName R61
SYMATTR Value 100k
SYMBOL voltage 2608 2064 M0
WINDOW 123 24 124 Left 2
WINDOW 39 0 0 Left 0
SYMATTR Value2 AC 1
SYMATTR InstName V9
SYMATTR Value ""
SYMBOL res 4480 2144 R270
WINDOW 0 32 56 VTop 2
WINDOW 3 0 56 VBottom 2
SYMATTR InstName R54
SYMATTR Value 318.3k
SYMBOL res 5184 2144 R270
WINDOW 0 32 56 VTop 2
WINDOW 3 0 56 VBottom 2
SYMATTR InstName R56
SYMATTR Value 318.3k
SYMBOL res 4944 2288 R180
WINDOW 0 36 76 Left 2
WINDOW 3 36 40 Left 2
SYMATTR InstName R57
SYMATTR Value 159.2k
SYMBOL ZZZ\\OpAmp\\TL072 3984 3104 M180
SYMATTR InstName U17
SYMBOL voltage 2560 3024 M0
WINDOW 123 24 124 Left 2
WINDOW 39 0 0 Left 0
SYMATTR Value2 AC 1
SYMATTR InstName V10
SYMATTR Value ""
SYMBOL res 3680 3104 R270
WINDOW 0 32 56 VTop 2
WINDOW 3 0 56 VBottom 2
SYMATTR InstName R58
SYMATTR Value 330k
SYMBOL res 3440 3248 R180
WINDOW 0 36 76 Left 2
WINDOW 3 36 40 Left 2
SYMATTR InstName R59
SYMATTR Value 165k
SYMBOL cap 3024 2960 R270
WINDOW 0 32 32 VTop 2
WINDOW 3 0 32 VBottom 2
SYMATTR InstName C29
SYMATTR Value 9n
SYMBOL cap 3632 2960 R270
WINDOW 0 32 32 VTop 2
WINDOW 3 0 32 VBottom 2
SYMATTR InstName C30
SYMATTR Value 11n
SYMBOL cap 3472 3152 R0
SYMATTR InstName C31
SYMATTR Value 19n
SYMBOL ZZZ\\OpAmp\\TL072 4016 3344 R180
SYMATTR InstName U18
SYMBOL res 4128 3216 R0
SYMATTR InstName R62
SYMATTR Value 1k
SYMBOL res 4128 3328 R0
SYMATTR InstName R63
SYMATTR Value 100k
SYMBOL res 3792 3168 R90
WINDOW 0 0 56 VBottom 2
WINDOW 3 32 56 VTop 2
SYMATTR InstName R64
SYMATTR Value 10Meg
SYMBOL res 2976 3104 R270
WINDOW 0 32 56 VTop 2
WINDOW 3 0 56 VBottom 2
SYMATTR InstName R65
SYMATTR Value 330k
SYMBOL res 3088 3168 R90
WINDOW 0 0 56 VBottom 2
WINDOW 3 32 56 VTop 2
SYMATTR InstName R66
SYMATTR Value 10Meg
SYMBOL res 3328 3248 R180
WINDOW 0 36 76 Left 2
WINDOW 3 36 40 Left 2
SYMATTR InstName R67
SYMATTR Value 5Meg
SYMBOL ZZZ\\OpAmp\\TL072 5440 3104 M180
SYMATTR InstName U19
SYMBOL res 5136 3104 R270
WINDOW 0 32 56 VTop 2
WINDOW 3 0 56 VBottom 2
SYMATTR InstName R68
SYMATTR Value 330k
SYMBOL res 4896 3248 R180
WINDOW 0 36 76 Left 2
WINDOW 3 36 40 Left 2
SYMATTR InstName R69
SYMATTR Value 165k
SYMBOL cap 4480 2960 R270
WINDOW 0 32 32 VTop 2
WINDOW 3 0 32 VBottom 2
SYMATTR InstName C32
SYMATTR Value 10n
SYMBOL cap 5088 2960 R270
WINDOW 0 32 32 VTop 2
WINDOW 3 0 32 VBottom 2
SYMATTR InstName C33
SYMATTR Value 10n
SYMBOL cap 4928 3152 R0
SYMATTR InstName C34
SYMATTR Value 20n
SYMBOL ZZZ\\OpAmp\\TL072 5472 3344 R180
SYMATTR InstName U20
SYMBOL res 5584 3216 R0
SYMATTR InstName R70
SYMATTR Value 1k
SYMBOL res 5584 3328 R0
SYMATTR InstName R71
SYMATTR Value 100k
SYMBOL res 5248 3168 R90
WINDOW 0 0 56 VBottom 2
WINDOW 3 32 56 VTop 2
SYMATTR InstName R72
SYMATTR Value 10Meg
SYMBOL res 4432 3104 R270
WINDOW 0 32 56 VTop 2
WINDOW 3 0 56 VBottom 2
SYMATTR InstName R73
SYMATTR Value 330k
SYMBOL res 4544 3168 R90
WINDOW 0 0 56 VBottom 2
WINDOW 3 32 56 VTop 2
SYMATTR InstName R74
SYMATTR Value 10Meg
SYMBOL res 4784 3248 R180
WINDOW 0 36 76 Left 2
WINDOW 3 36 40 Left 2
SYMATTR InstName R75
SYMATTR Value 5Meg
TEXT -1648 -32 Left 2 !;tran 0 20m 0 0.5u
TEXT -1888 360 Left 2 !.ac dec 10000 30 70
TEXT -984 -400 Left 2 !.param f_bottom = 40
TEXT -984 -368 Left 2 !.param f_top = 70
TEXT -648 -400 Left 2 !.param R_big = 470k
TEXT -648 -368 Left 2 !.param R_small = 10k
TEXT -344 -400 Left 2 !.param C_big_top = 1 / 2 / pi / R_big / f_top
TEXT -344 -368 Left 2 !.param C_small_top = 1 / 2 / pi / R_small / f_top
TEXT 272 -400 Left 2 !.param C_big_bottom = 1 / 2 / pi / R_big / f_bottom
TEXT 272 -368 Left 2 !.param C_small_bottom = 1 / 2 / pi / R_small / f_bottom

The netlist it stands for:
* mains_bandstop_2.asc
V2 5V 0 5
V7 N003 2.5V AC 1
R14 N002 N018 20k
XU7 N024 N002 5V 0 N018 LT1006  ; pins In+ In- V+ V- OUT
R18 2.5V N024 10k
R16 N001 N002 20k
R20 N017 N002 20k
V1 2.5V 0 2.5
C2 N004 N003 {C_small_top}
R2 2.5V N005 {R_big}
C3 N005 N004 {C_big_top}
R3 2.5V N004 {R_small}
XU3 N023 N017 5V 0 N017 TL072  ; pins 1 2 3 4 5
XU4 N005 N001 5V 0 N001 TL072  ; pins 1 2 3 4 5
R1 N003 N022 {R_small}
R4 N022 N023 {R_big}
C4 0 N022 {C_small_bottom}
C1 0 N023 {C_big_bottom}
XU1 N008 N015 15V 0 N015 TL072  ; pins 1 2 3 4 5
R5 N006 N016 320k
V3 N006 5V AC 1m
R6 N016 N008 320k
R7 N026 N007 160k
C6 N006 N007 10n
C7 N007 N008 10n
C5 N016 N026 20n
XU2 N025 N026 15V 0 N026 TL072  ; pins 1 2 3 4 5
R8 N015 N025 1k
R9 N025 0 49k
V4 15V 0 15
XU5 5V N036 15V 0 N040 TL072  ; pins 1 2 3 4 5
R10 N034 N042 320k
V5 N034 5V AC 1m
R11 N042 N036 320k
R12 N040 N035 160k
C8 N034 N035 10n
C9 N035 N036 10n
C10 N042 N040 20n
R13 N040 N036 10Meg
XU6 N011 N012 15V 0 N012 TL072  ; pins 1 2 3 4 5
V6 N009 5V AC 1
R17 N019 N011 330k
R19 N029 N010 165k
C11 N009 N010 10n
C12 N010 N011 10n
C13 N019 N029 20n
XU8 N027 N029 15V 0 N029 TL072  ; pins 1 2 3 4 5
R21 N012 N027 1k
R22 N027 0 100k
R23 N011 N019 10Meg
R24 N009 N019 330k
R25 N019 N009 10Meg
R15 N029 N010 5Meg
XU9 N014 N021 15V 0 N021 TL072  ; pins 1 2 3 4 5
R26 N020 N014 330k
R27 N030 N013 165k
C14 N012 N013 10n
C15 N013 N014 10n
C16 N020 N030 20n
XU10 N028 N030 15V 0 N030 TL072  ; pins 1 2 3 4 5
R28 N021 N028 1k
R29 N028 0 100k
R30 N014 N020 10Meg
R31 N012 N020 330k
R32 N020 N012 10Meg
R33 N030 N013 5Meg
XU11 N039 N031 15V 0 N031 TL072  ; pins 1 2 3 4 5
V8 N037 5V AC 1
R34 N044 N039 330k
R35 N046 N038 165k
C17 N037 N038 10n
C18 N038 N039 10n
C19 N044 N046 20n
R38 N039 N044 10Meg
R39 N037 N044 330k
R40 N044 N037 10Meg
R41 N046 N038 5Meg
R36 N031 N046 1k
R37 N046 0 100k
XU12 N033 N043 15V 0 N043 TL072  ; pins 1 2 3 4 5
R42 N041 N033 330k
R43 N045 N032 165k
C20 N031 N032 10n
C21 N032 N033 10n
C22 N041 N045 20n
R44 N033 N041 10Meg
R45 N031 N041 330k
R46 N041 N031 10Meg
R47 N045 N032 5Meg
R48 N043 N045 1k
R49 N045 0 100k
XU13 N049 N050 15V 0 N050 TL072  ; pins 1 2 3 4 5
R50 N053 N049 318.3k
R51 N058 N048 159.2k
C23 N047 N048 10n
C24 N048 N049 10n
C25 N053 N058 20n
XU14 N056 N058 15V 0 N058 TL072  ; pins 1 2 3 4 5
R52 N050 N056 1k
R53 N056 0 100k
R55 N047 N053 318.3k
XU15 N052 N055 15V 0 N055 TL072  ; pins 1 2 3 4 5
C26 N050 N051 10n
C27 N051 N052 10n
C28 N054 N059 20n
XU16 N057 N059 15V 0 N059 TL072  ; pins 1 2 3 4 5
R60 N055 N057 1k
R61 N057 0 100k
V9 N047 5V AC 1
R54 N050 N054 318.3k
R56 N054 N052 318.3k
R57 N059 N051 159.2k
XU17 N062 N063 15V 0 N063 TL072  ; pins 1 2 3 4 5
V10 N060 5V AC 1
R58 N066 N062 330k
R59 N071 N061 165k
C29 N060 N061 9n
C30 N061 N062 11n
C31 N066 N071 19n
XU18 N069 N071 15V 0 N071 TL072  ; pins 1 2 3 4 5
R62 N063 N069 1k
R63 N069 0 100k
R64 N062 N066 10Meg
R65 N060 N066 330k
R66 N066 N060 10Meg
R67 N071 N061 5Meg
XU19 N065 N068 15V 0 N068 TL072  ; pins 1 2 3 4 5
R68 N067 N065 330k
R69 N072 N064 165k
C32 N063 N064 10n
C33 N064 N065 10n
C34 N067 N072 20n
XU20 N070 N072 15V 0 N072 TL072  ; pins 1 2 3 4 5
R70 N068 N070 1k
R71 N070 0 100k
R72 N065 N067 10Meg
R73 N063 N067 330k
R74 N067 N063 10Meg
R75 N072 N064 5Meg
;tran 0 20m 0 0.5u
.ac dec 10000 30 70
.param f_bottom = 40
.param f_top = 70
.param R_big = 470k
.param R_small = 10k
.param C_big_top = 1 / 2 / pi / R_big / f_top
.param C_small_top = 1 / 2 / pi / R_small / f_top
.param C_big_bottom = 1 / 2 / pi / R_big / f_bottom
.param C_small_bottom = 1 / 2 / pi / R_small / f_bottom
.lib LTC.lib
.lib TL072.cir
.backanno
.end